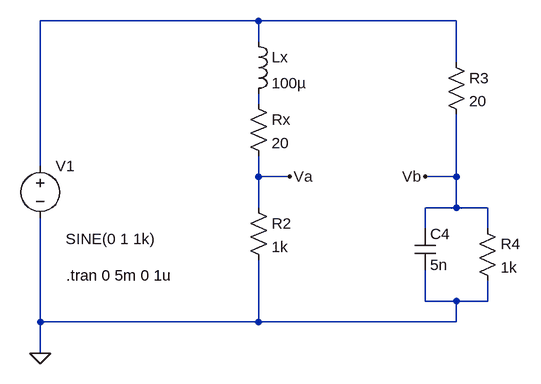
[diagram p0: schematic Maxwell-Wien.asc]
Maxwell-Wien.asc, the LTspice schematic file:
Version 4
SHEET 1 880 680
WIRE 112 32 -224 32
WIRE 416 32 112 32
WIRE 112 64 112 32
WIRE 416 96 416 32
WIRE 112 160 112 144
WIRE -224 256 -224 32
WIRE 112 272 112 240
WIRE 160 272 112 272
WIRE 416 272 416 176
WIRE 416 272 368 272
WIRE 112 320 112 272
WIRE 416 320 416 272
WIRE 416 320 368 320
WIRE 464 320 416 320
WIRE 368 352 368 320
WIRE 464 352 464 320
WIRE 368 464 368 416
WIRE 416 464 368 464
WIRE 464 464 464 432
WIRE 464 464 416 464
WIRE -224 496 -224 336
WIRE 112 496 112 400
WIRE 112 496 -224 496
WIRE 416 496 416 464
WIRE 416 496 112 496
WIRE -224 544 -224 496
FLAG -224 544 0
FLAG 160 272 Va
FLAG 368 272 Vb
SYMBOL cap 352 352 R0
SYMATTR InstName C4
SYMATTR Value 5n
SYMBOL res 96 144 R0
SYMATTR InstName Rx
SYMATTR Value 20
SYMBOL res 96 304 R0
SYMATTR InstName R2
SYMATTR Value 1k
SYMBOL res 400 80 R0
SYMATTR InstName R3
SYMATTR Value 20
SYMBOL res 448 336 R0
SYMATTR InstName R4
SYMATTR Value 1k
SYMBOL voltage -224 240 R0
WINDOW 39 0 0 Left 2
WINDOW 3 39 128 Left 2
SYMATTR Value2 AC 1
SYMATTR InstName V1
SYMATTR Value SINE(0 1 1k)
SYMBOL ind 96 48 R0
SYMATTR InstName Lx
SYMATTR Value 100µ
TEXT -184 424 Left 2 !.tran 0 5m 0 1u

The netlist it stands for:
* Maxwell-Wien.asc
C4 Vb 0 5n
Rx N002 Va 20
R2 Va 0 1k
R3 N001 Vb 20
R4 Vb 0 1k
V1 N001 0 SINE(0 1 1k) AC 1
Lx N001 N002 100µ
.tran 0 5m 0 1u
.backanno
.end